# EAGLE schematic fitnessband (EAGLE 7.4.0)

## Sheet 1 of 6
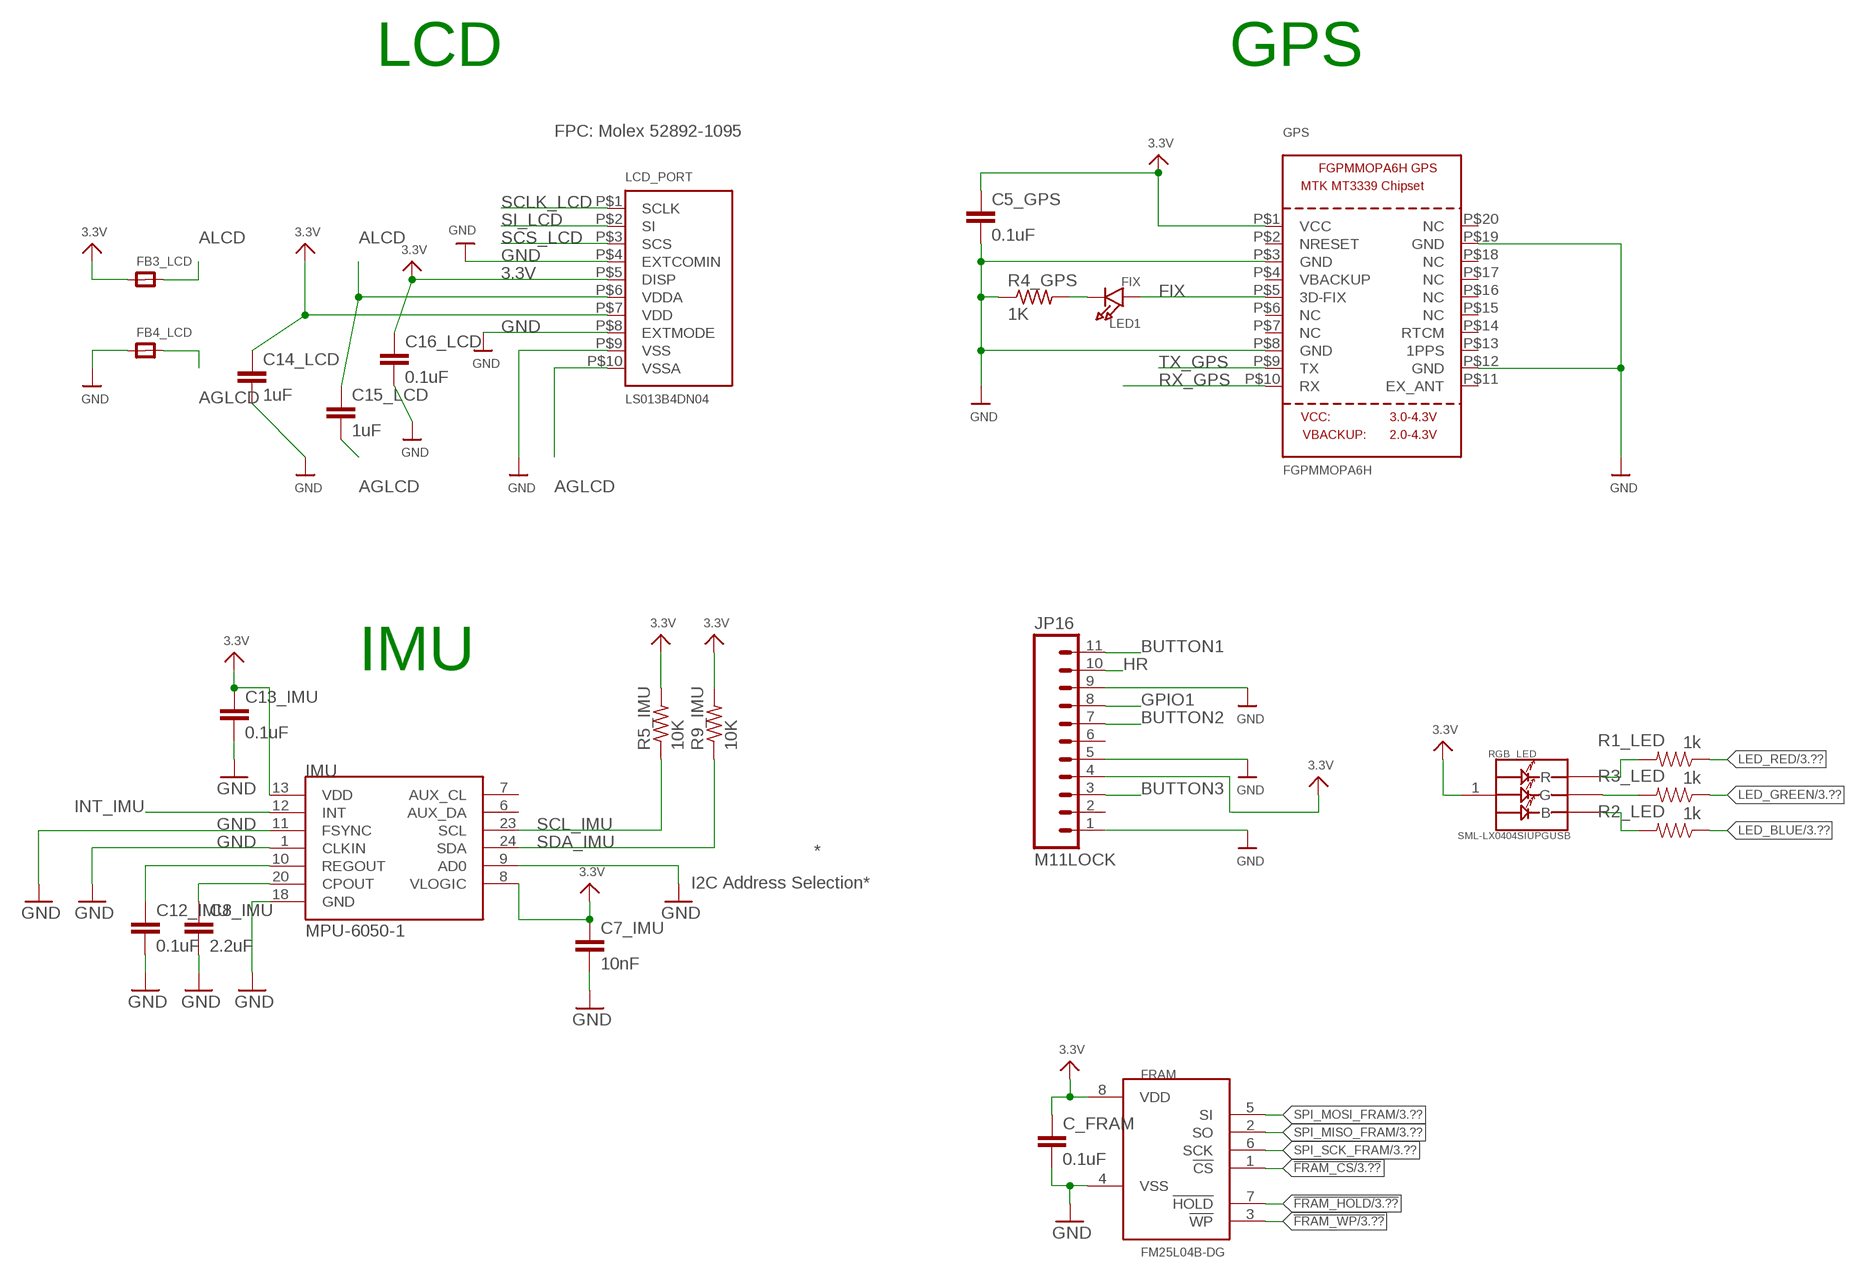
[diagram p0: schematic, sheet 1]

### Parts
C5_GPS  0.1uF  C-EUC0402  [C0402]
C7_IMU  10nF  C-EUC0402  [C0402]
C8_IMU  2.2uF  C-EUC0402  [C0402]
C12_IMU  0.1uF  C-EUC0402  [C0402]
C13_IMU  0.1uF  C-EUC0402  [C0402]
C14_LCD  1uF  C-EUC0402  [C0402]
C15_LCD  1uF  C-EUC0402  [C0402]
C16_LCD  0.1uF  C-EUC0402  [C0402]
C_FRAM  0.1uF  C-EUC0402  [C0402]
FB3_LCD  FERRITE_0805  [_0805]
FB4_LCD  FERRITE_0805  [_0805]
FRAM  FM25L04B-DG  [TDFN-8]
GPS  FGPMMOPA6H  GPS_FGPMMOPA6H  [FGPMMOPA6H]
IMU  MPU-6050-1  [QFN-24-4MM2]
JP16  M11LOCK  [1X11_LOCK]
LCD_PORT  LS013B4DN04  SHARP_MEMORYLCD_10PIN  [FPC_10PIN_52892-1095]
LED1  FIX  LED0805  [CHIPLED_0805]
R1_LED  1k  RESISTOR0402_RES  [0402_RES]
R2_LED  1k  RESISTOR0402_RES  [0402_RES]
R3_LED  1k  RESISTOR0402_RES  [0402_RES]
R4_GPS  1K  R-US_R0402  [R0402]
R5_IMU  10K  R-US_R0402  [R0402]
R9_IMU  10K  R-US_R0402  [R0402]
RGB_LED  SML-LX0404SIUPGUSB  [1MM_SQ_4PAD]

### Nets
3.3V: C5_GPS.1 C7_IMU.1 C13_IMU.1 C14_LCD.1 C16_LCD.1 C_FRAM.1 FB3_LCD.1 FRAM.8(VDD) GPS.P$1(VCC) IMU.8(VLOGIC) IMU.13(VDD) JP16.4 LCD_PORT.P$5(DISP) LCD_PORT.P$7(VDD) R5_IMU.2 R9_IMU.2 RGB_LED.1(VDD) ; also sheet 2,3
!FRAM_CS: FRAM.1(!CS) ; also sheet 3
!FRAM_HOLD: FRAM.7(!HOLD) ; also sheet 3
!FRAM_WP: FRAM.3(!WP) ; also sheet 3
AGLCD: C15_LCD.2 FB4_LCD.2 LCD_PORT.P$10(VSSA)
ALCD: C15_LCD.1 FB3_LCD.2 LCD_PORT.P$6(VDDA)
BUTTON1: JP16.11 ; also sheet 3
BUTTON2: JP16.7 ; also sheet 3
BUTTON3: JP16.3 ; also sheet 3
FIX: GPS.P$5(3D-FIX) LED1.A
GND: C5_GPS.2 C7_IMU.2 C8_IMU.2 C12_IMU.2 C13_IMU.2 C14_LCD.2 C16_LCD.2 C_FRAM.2 FB4_LCD.1 FRAM.4(VSS) GPS.P$3(GND) GPS.P$8(GND) GPS.P$12(GND) GPS.P$19(GND) IMU.1(CLKIN) IMU.9(AD0) IMU.11(FSYNC) IMU.18(GND) JP16.1 JP16.5 JP16.9 LCD_PORT.P$4(EXTCOMIN) LCD_PORT.P$8(EXTMODE) LCD_PORT.P$9(VSS) R4_GPS.1 ; also sheet 2,3
GPIO1: JP16.8 ; also sheet 3
HR: JP16.10 ; also sheet 3
INT_IMU: IMU.12(INT) ; also sheet 3
LED_BLUE: R2_LED.1 ; also sheet 3
LED_GREEN: R3_LED.1 ; also sheet 3
LED_RED: R1_LED.1 ; also sheet 3
N$1: R1_LED.2 RGB_LED.2(R)
N$2: R3_LED.2 RGB_LED.4(G)
N$3: R2_LED.2 RGB_LED.3(B)
N$23: LED1.C R4_GPS.2
N$48: C8_IMU.1 IMU.20(CPOUT)
N$49: C12_IMU.1 IMU.10(REGOUT)
RX_GPS: GPS.P$10(RX) ; also sheet 3
SCL_IMU: IMU.23(SCL) R5_IMU.1 ; also sheet 3
SCLK_LCD: LCD_PORT.P$1(SCLK) ; also sheet 3
SCS_LCD: LCD_PORT.P$3(SCS) ; also sheet 3
SDA_IMU: IMU.24(SDA) R9_IMU.1 ; also sheet 3
SI_LCD: LCD_PORT.P$2(SI) ; also sheet 3
SPI_MISO_FRAM: FRAM.2(SO) ; also sheet 3
SPI_MOSI_FRAM: FRAM.5(SI) ; also sheet 3
SPI_SCK_FRAM: FRAM.6(SCK) ; also sheet 3
TX_GPS: GPS.P$9(TX) ; also sheet 3
Unconnected: GPS.P$2(NRESET) GPS.P$4(VBACKUP) GPS.P$6(NC) GPS.P$7(NC) GPS.P$11(EX_ANT) GPS.P$13(1PPS) GPS.P$14(RTCM) GPS.P$15(NC) GPS.P$16(NC) GPS.P$17(NC) GPS.P$18(NC) GPS.P$20(NC) IMU.6(AUX_DA) IMU.7(AUX_CL) JP16.2 JP16.6

### Notes on the sheet
- LCD | GPS
- FPC: Molex 52892-1095
- IMU
- *
- I2C Address Selection*

## Sheet 2 of 6
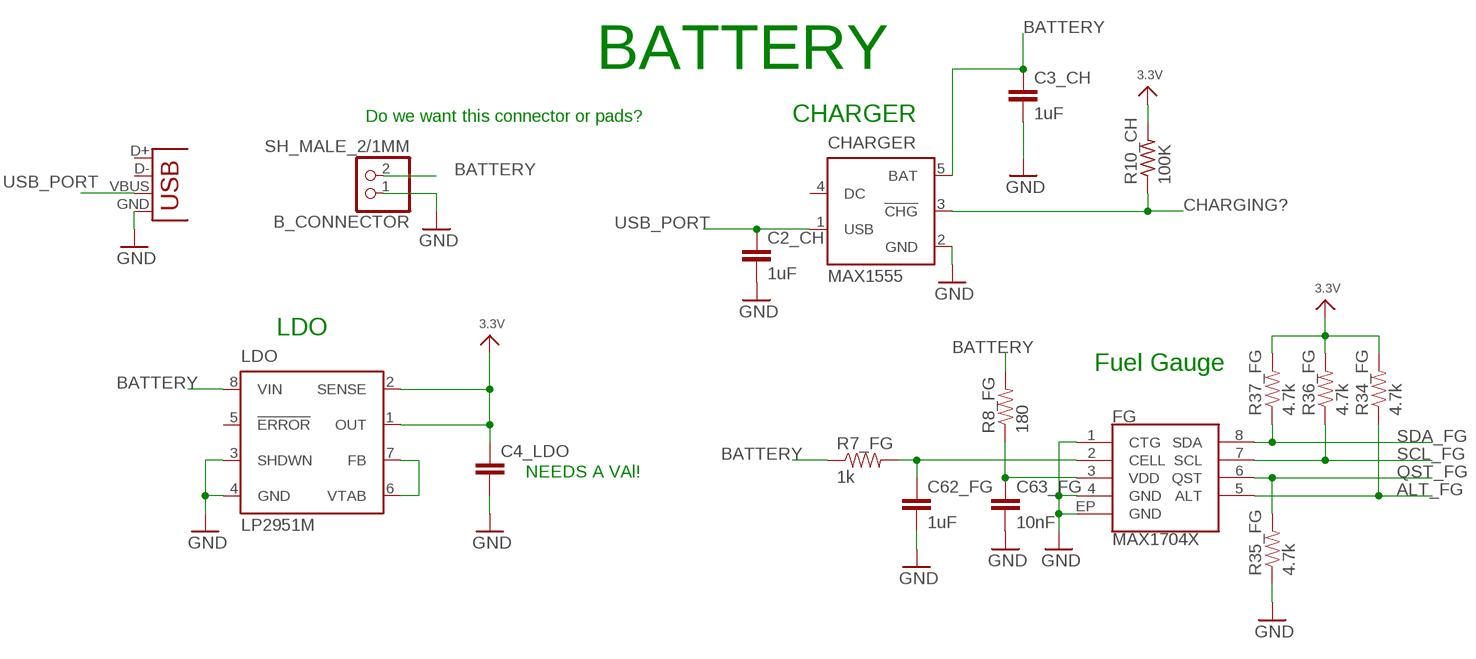
[diagram p1: schematic, sheet 2]

### Parts
B_CONNECTOR  SH_MALE_2/1MM  [SH-1X2/1MM]
C2_CH  1uF  C-EUC0402  [C0402]
C3_CH  1uF  C-EUC0402  [C0402]
C4_LDO  C-EUC0402  [C0402]
C62_FG  1uF  CAP0402-CAP  [0402-CAP]
C63_FG  10nF  CAP0402-CAP  [0402-CAP]
CHARGER  MAX1555  [SOT23-5L]
FG  MAX1704X  [TDFN-8]
LDO  LP2951M  [SO08]
R7_FG  1k  RESISTOR0402-RES  [0402-RES]
R8_FG  180  RESISTOR0402-RES  [0402-RES]
R10_CH  100K  R-US_R0402  [R0402]
R34_FG  4.7k  RESISTOR0402-RES  [0402-RES]
R35_FG  4.7k  RESISTOR0402-RES  [0402-RES]
R36_FG  4.7k  RESISTOR0402-RES  [0402-RES]
R37_FG  4.7k  RESISTOR0402-RES  [0402-RES]
X5  USB-MICROB  [USB-MICROB]

### Nets
3.3V: C4_LDO.1 LDO.1(OUT) LDO.2(SENSE) R10_CH.2 R34_FG.2 R36_FG.2 R37_FG.2 ; also sheet 1,3
ALT_FG: FG.5(ALT) R34_FG.1 ; also sheet 3
BATTERY: B_CONNECTOR.2 C3_CH.1 CHARGER.5(BAT) LDO.8(VIN) R7_FG.1 R8_FG.2
CHARGING?: CHARGER.3(!CHG) R10_CH.1
GND: B_CONNECTOR.1 C2_CH.2 C3_CH.2 C4_LDO.2 C62_FG.2 C63_FG.2 CHARGER.2(GND) FG.1(CTG) FG.4(GND) FG.EP(GND) LDO.3(SHDWN) LDO.4(GND) R35_FG.1 X5.GND ; also sheet 1,3
N$4: LDO.6(VTAB) LDO.7(FB)
N$47: C62_FG.1 FG.2(CELL) R7_FG.2
QST_FG: FG.6(QST) R35_FG.2 ; also sheet 3
SCL_FG: FG.7(SCL) R36_FG.1 ; also sheet 3
SDA_FG: FG.8(SDA) R37_FG.1 ; also sheet 3
USB_PORT: C2_CH.1 CHARGER.1(USB) X5.VBUS
VDD: C63_FG.1 FG.3(VDD) R8_FG.1
Unconnected: CHARGER.4(DC) LDO.5(!ERROR) X5.D+ X5.D-

### Notes on the sheet
- BATTERY
- Do we want this connector or pads? | CHARGER
- LDO
- Fuel Gauge
- NEEDS A VAl!

## Sheet 3 of 6
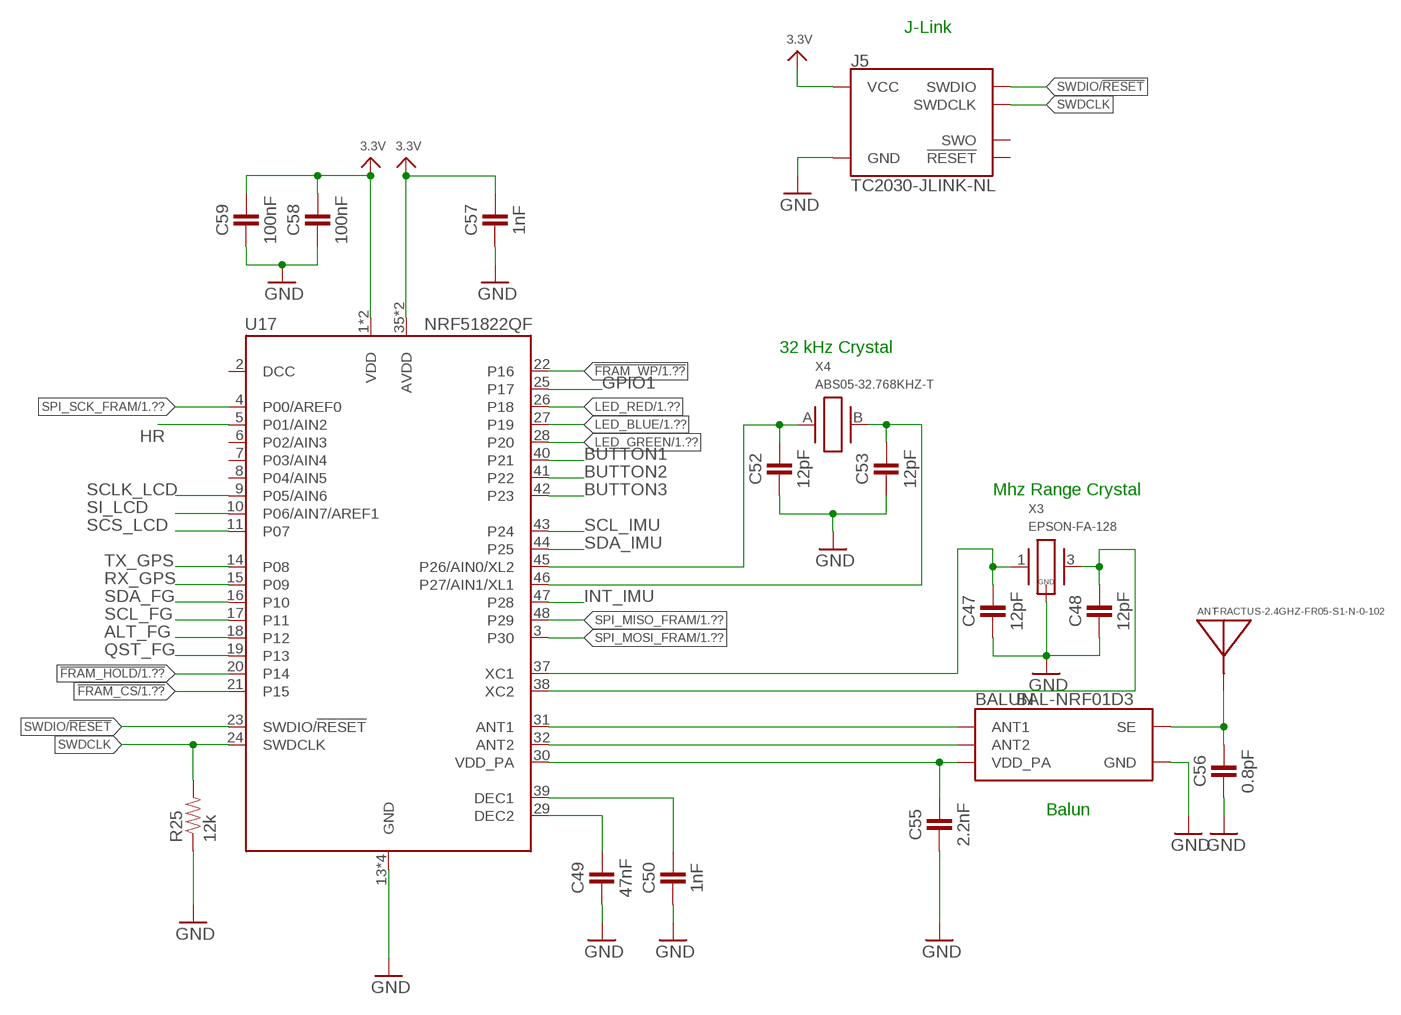
[diagram p2: schematic, sheet 3]

### Parts
ANT  FRACTUS-2.4GHZ-FR05-S1-N-0-102  [FRACTUS-ANTENNA-FR05-S1-N-0-102]
BALUN  BAL-NRF01D3  [BAL-NRF01D3]
C47  12pF  CAPACITOR  [0402_CAP]
C48  12pF  CAPACITOR  [0402_CAP]
C49  47nF  CAPACITOR  [0402_CAP]
C50  1nF  CAPACITOR  [0402_CAP]
C52  12pF  CAPACITOR  [0402_CAP]
C53  12pF  CAPACITOR  [0402_CAP]
C55  2.2nF  CAPACITOR  [0402_CAP]
C56  0.8pF  CAPACITOR  [0402_CAP]
C57  1nF  CAPACITOR  [0402_CAP]
C58  100nF  CAPACITOR  [0402_CAP]
C59  100nF  CAPACITOR  [0402_CAP]
J5  TC2030-JLINK-NL  [TC2030-IDC-NL]
R25  12k  RESISTOR0402_RES  [0402_RES]
U17  NRF51822QF  [QFN-48-6MM]
X3  EPSON-FA-128  [FA-128]
X4  ABS05-32.768KHZ-T  [ABS05]

### Nets
3.3V: C57.1 C58.1 C59.1 J5.1(VCC) U17.1(VDD) U17.12(VDD) U17.35(AVDD) U17.36(AVDD) ; also sheet 1,2
!FRAM_CS: U17.21(P15) ; also sheet 1
!FRAM_HOLD: U17.20(P14) ; also sheet 1
!FRAM_WP: U17.22(P16) ; also sheet 1
ALT_FG: U17.18(P12) ; also sheet 2
ANTENNA1: ANT.1(ANTENNA) BALUN.SE C56.1
BUTTON1: U17.40(P21) ; also sheet 1
BUTTON2: U17.41(P22) ; also sheet 1
BUTTON3: U17.42(P23) ; also sheet 1
GND: BALUN.GND C47.2 C48.2 C49.2 C50.2 C52.2 C53.2 C55.2 C56.2 C57.2 C58.2 C59.2 J5.5(GND) R25.1 U17.13(GND) U17.33(GND) U17.34(GND) U17.GND X3.2(GND) X3.4(GND) ; also sheet 1,2
GPIO1: U17.25(P17) ; also sheet 1
HR: U17.5(P01/AIN2) ; also sheet 1
INT_IMU: U17.47(P28) ; also sheet 1
LED_BLUE: U17.27(P19) ; also sheet 1
LED_GREEN: U17.28(P20) ; also sheet 1
LED_RED: U17.26(P18) ; also sheet 1
N$25: C47.1 U17.37(XC1) X3.1
N$26: C48.1 U17.38(XC2) X3.3
N$27: C49.1 U17.29(DEC2)
N$28: C52.1 U17.45(P26/AIN0/XL2) X4.A
N$29: C53.1 U17.46(P27/AIN1/XL1) X4.B
N$32: C50.1 U17.39(DEC1)
N$33: BALUN.ANT1 U17.31(ANT1)
N$34: BALUN.ANT2 U17.32(ANT2)
N$35: BALUN.VCC(VDD_PA) C55.1 U17.30(VDD_PA)
QST_FG: U17.19(P13) ; also sheet 2
RX_GPS: U17.15(P09) ; also sheet 1
SCL_FG: U17.17(P11) ; also sheet 2
SCL_IMU: U17.43(P24) ; also sheet 1
SCLK_LCD: U17.9(P05/AIN6) ; also sheet 1
SCS_LCD: U17.11(P07) ; also sheet 1
SDA_FG: U17.16(P10) ; also sheet 2
SDA_IMU: U17.44(P25) ; also sheet 1
SI_LCD: U17.10(P06/AIN7/AREF1) ; also sheet 1
SPI_MISO_FRAM: U17.48(P29) ; also sheet 1
SPI_MOSI_FRAM: U17.3(P30) ; also sheet 1
SPI_SCK_FRAM: U17.4(P00/AREF0) ; also sheet 1
SWDCLK: J5.4(SWDCLK) R25.2 U17.24(SWDCLK)
SWDIO/!RESET: J5.2(SWDIO) U17.23(SWDIO/!RESET)
TX_GPS: U17.14(P08) ; also sheet 1
Unconnected: J5.3(!RESET) J5.6(SWO) U17.2(DCC) U17.6(P02/AIN3) U17.7(P03/AIN4) U17.8(P04/AIN5)

### Notes on the sheet
- J-Link
- 32 kHz Crystal
- Mhz Range Crystal
- Balun

## Sheet 4 of 6

## Sheet 5 of 6

## Sheet 6 of 6

## Library data of the parts
ANT = chips:FRACTUS-2.4GHZ-FR05-S1-N-0-102: Fractus Compact Reach XtendTM chip antenna is engineered specifically for Bluetooth, WLAN 802.11 b/g/n and other wireless devices operating at the ISM 2.4 GHz band. Compact Reach Xtend combines small form factor size and high performance to improve the functionality of your wireless devices.; RICHARDSON_RFPD: FR05-S1-N-0102B
B_CONNECTOR = headers:SH_MALE_2/1MM: 1.0mm pitch/Disconnectable Crimp style connectors; DIGIKEY: 455-1788-2-ND
BALUN = chips:BAL-NRF01D3: 50 ohm nominal input / conjugate match balun to nRF51422-QFAA, nRF24LE1, nRF51822-QFAA/AB, with integrated harmonic filter; DIGIKEY: 497-13637-1-ND; MOUSER: 511-BAL-NRF01D3
C2_CH C3_CH C4_LDO C5_GPS C7_IMU C8_IMU C12_IMU C13_IMU C14_LCD C15_LCD C16_LCD C_FRAM = resistor:C-EU: CAPACITOR, European symbol
C47-C50 C52 C53 C55-C59 = passives:CAPACITOR: 0402 Capacitor
C62_FG C63_FG = SparkFun:CAP: Capacitor Standard 0603 ceramic capacitor, and 0.1" leaded capacitor.
CHARGER = maxim:MAX1555: Dual-Input USB/AC Adapter 1-Cell Li+ Battery Chargers Source: http://www.maxim-ic.com .. MAX1551-MAX1555.pdf; MF: MAXIM; MPN: MAX1555EZK+T; OC_FARNELL: 1628222; OC_NEWARK: 59J2761
FB3_LCD FB4_LCD = microbuilder:FERRITE: Ferrite Bead 0603 MMZ1608B121C - 120 Ohm @ 100MHz, 600mA, 0.15 Ohm DC Resistance - Digikey: 445-2164-1-ND BK1608HW121-T - 120 Ohm, 600mA Ferrite Chip - Digikey: 587-1876-2-ND 0805 HZ0805B272R-10 - 2.7K Ohm @ 100MHz, 200mA, 0.8 Ohm DC Resistance - Digikey: 240-2504-1-ND (see also Murata BLM21BD272SN1L) MMZ2012Y152B - 1.5K Ohm @ 100MHz, 500mA, 0.4 Ohm DC Resistance - Digikey: 445-1560-1-ND - Mainly for high frequency (80-400MHz) MMZ2012R102A - 1K Ohm @ 100MHz, 500mA, 0.3 Ohm DC Resistance - Digikey: 445-1555-2-ND - More general purpose (10-200MHz)
FG = SparkFun:MAX1704X: MAX17043/MAX17044: Battery Fuel Guage (43 is 1cell, 44 is 2cell)
FRAM = chips:FM25: Cypress FRAM; DIGIKEY: FM25L04B-DGRA-ND; MOUSER: 877-FM25L04B-DG
GPS = microbuilder:GPS_FGPMMOPA6H: GPS Module - MTK MT3339 Chipset, -165dBm sensitivity, 22 channels, 10Hz, auto-select external antenna options
IMU = Testing:MPU-6050
J5 = connector:TC2030-JLINK
JP16 = SparkFun:M11: Header 11 Standard 11-pin 0.1" header. Use with straight break away headers (SKU : PRT-00116), right angle break away headers (PRT-00553), swiss pins (PRT-00743), machine pins (PRT-00117), and female headers (PRT-00115).
LCD_PORT = microbuilder:SHARP_MEMORYLCD_10PIN: Sharp Mono Memory LCD LS013B4DN02 - 1.35" 96x96 Pixels LS027B7DH01 - 2.7" 400x240 Pixels
LDO = national-semiconductor:LP2951: Adjustable Micropower Voltage Regulator Source: http://www.national.com/ds/LP/LP2950.pdf; MF: FAIRCHILD SEMICONDUCTOR; MPN: LP2951CM; OC_FARNELL: 9488561; OC_NEWARK: 78K6014
LED1 = microbuilder:LED: LED 0603 - 0603 Surface Mount Package 2mA: Green LED - Low Power (3.9mcd, 2ma, 1.7Vf) - Digikey: 475-2709-2-ND Orange LED - Low Power (9.8mcd, 2ma, 1.8Vf) - Digikey: 475-1194-2-ND Red LED - Low Power (5mcd, 2ma, 1.8Vf) - Digikey: 475-1195-2-ND Yellow LED - Low Power (7mcd, 2ma, 1.8Vf) - Digikey: 475-1196-2-ND 5mA: Blue LED - Low Power (17mcd, 5ma, 2.9Vf) - Digikey: LNJ937W8CRACT-ND 0805 - 0805 Surface Mount Package 2mA: Red LED (8.8mcd, 2mA, 1.8Vf, Clear) - Low Power [Digikey: 475-2510-1-ND] Green LED (5mcd, 2mA, 1.8Vf, Clear) - Low Power [Digikey: 475-2730-1-ND] Yellow LED (11.3mcd, 2mA, 1.8Vf, Clear) - Low Power [Digikey: 475-2555-1-ND] 20mA: Red LED (104mcd, 20mA, Diffused) - LS R976 [Digikey: 475-1278-6-ND] Red LED (12mcd, 20mA, 2.0Vf, Clear) - APT2012EC [Digikey: 754-1128-1-ND] Green LED (15mcd, 20mA, 2.2Vf, Clear) - APT2012GC [Digikey: 754-1131-1-ND] Orange LED (160mcd, 20mA, 2.1Vf, Clear) - APT2012SECK [Digikey: 754-1130-1-ND] 1206 - 1206 Surface Mount Package Green LED (26mcd, 20mA, Diffused) - LG N971 [Digikey: 475-1407-6-ND] Red LED (15mcd, 20mA, Diffused) - LH N974 [Digikey: 475-1416-6-ND]
R1_LED R2_LED R3_LED R25 = passives:RESISTOR: Resistor Basic schematic elements and footprints for 0603, 1206, and PTH resistors.
R4_GPS R5_IMU R9_IMU R10_CH = resistor:R-US_: RESISTOR, American symbol
R7_FG R8_FG R34_FG R35_FG R36_FG R37_FG = SparkFun:RESISTOR: Resistor Basic schematic elements and footprints for 0603, 1206, and PTH resistors.
RGB_LED = leds:SML-LX0404SIUPGUSB: 1mm^2 RGB LED; DIGIKEY: 67-2125-1-ND
U17 = chips:NRF51822: Multiprotocol Bluetooth® 4.0 low energy/2.4 GHz RF SoC; DIGIKEY: 1490-1032-1-ND; MOUSER: 949-NRF51822-QFAB-R7
X3 = crystals:EPSON-FA-128: MHz RANGE CRYSTAL UNIT ULTRA MINIATURE SIZE LOW PROFILE SMD http://www.digikey.com/product-search/en?FV=ffec63d1
X4 = crystals:ABS05-32.768KHZ: 32.768kHz Crystal; DIGIKEY: 535-11899-1-ND
X5 = SparkFun:USB: USB Connectors USB-B-PTH is fully proven SKU : PRT-00139 USB-miniB is fully proven SKU : PRT-00587 USB-A-PCB is untested. USB-A-H is throughly reviewed, but untested. Spark Fun Electronics SKU : PRT-00437 USB-B-SMT is throughly reviewed, but untested. Needs silkscreen touching up. USB-A-S has not been used/tested USB-MB-H has not been used/tested